# EasyEDA schematic EasyEDA.json
TITLE: Micromouse; REV: 1.0; Date: 2022-02-14; Sheet: 1/1; Drawn By: Adil, Sachin, Rafid; Company: Psycho Rats
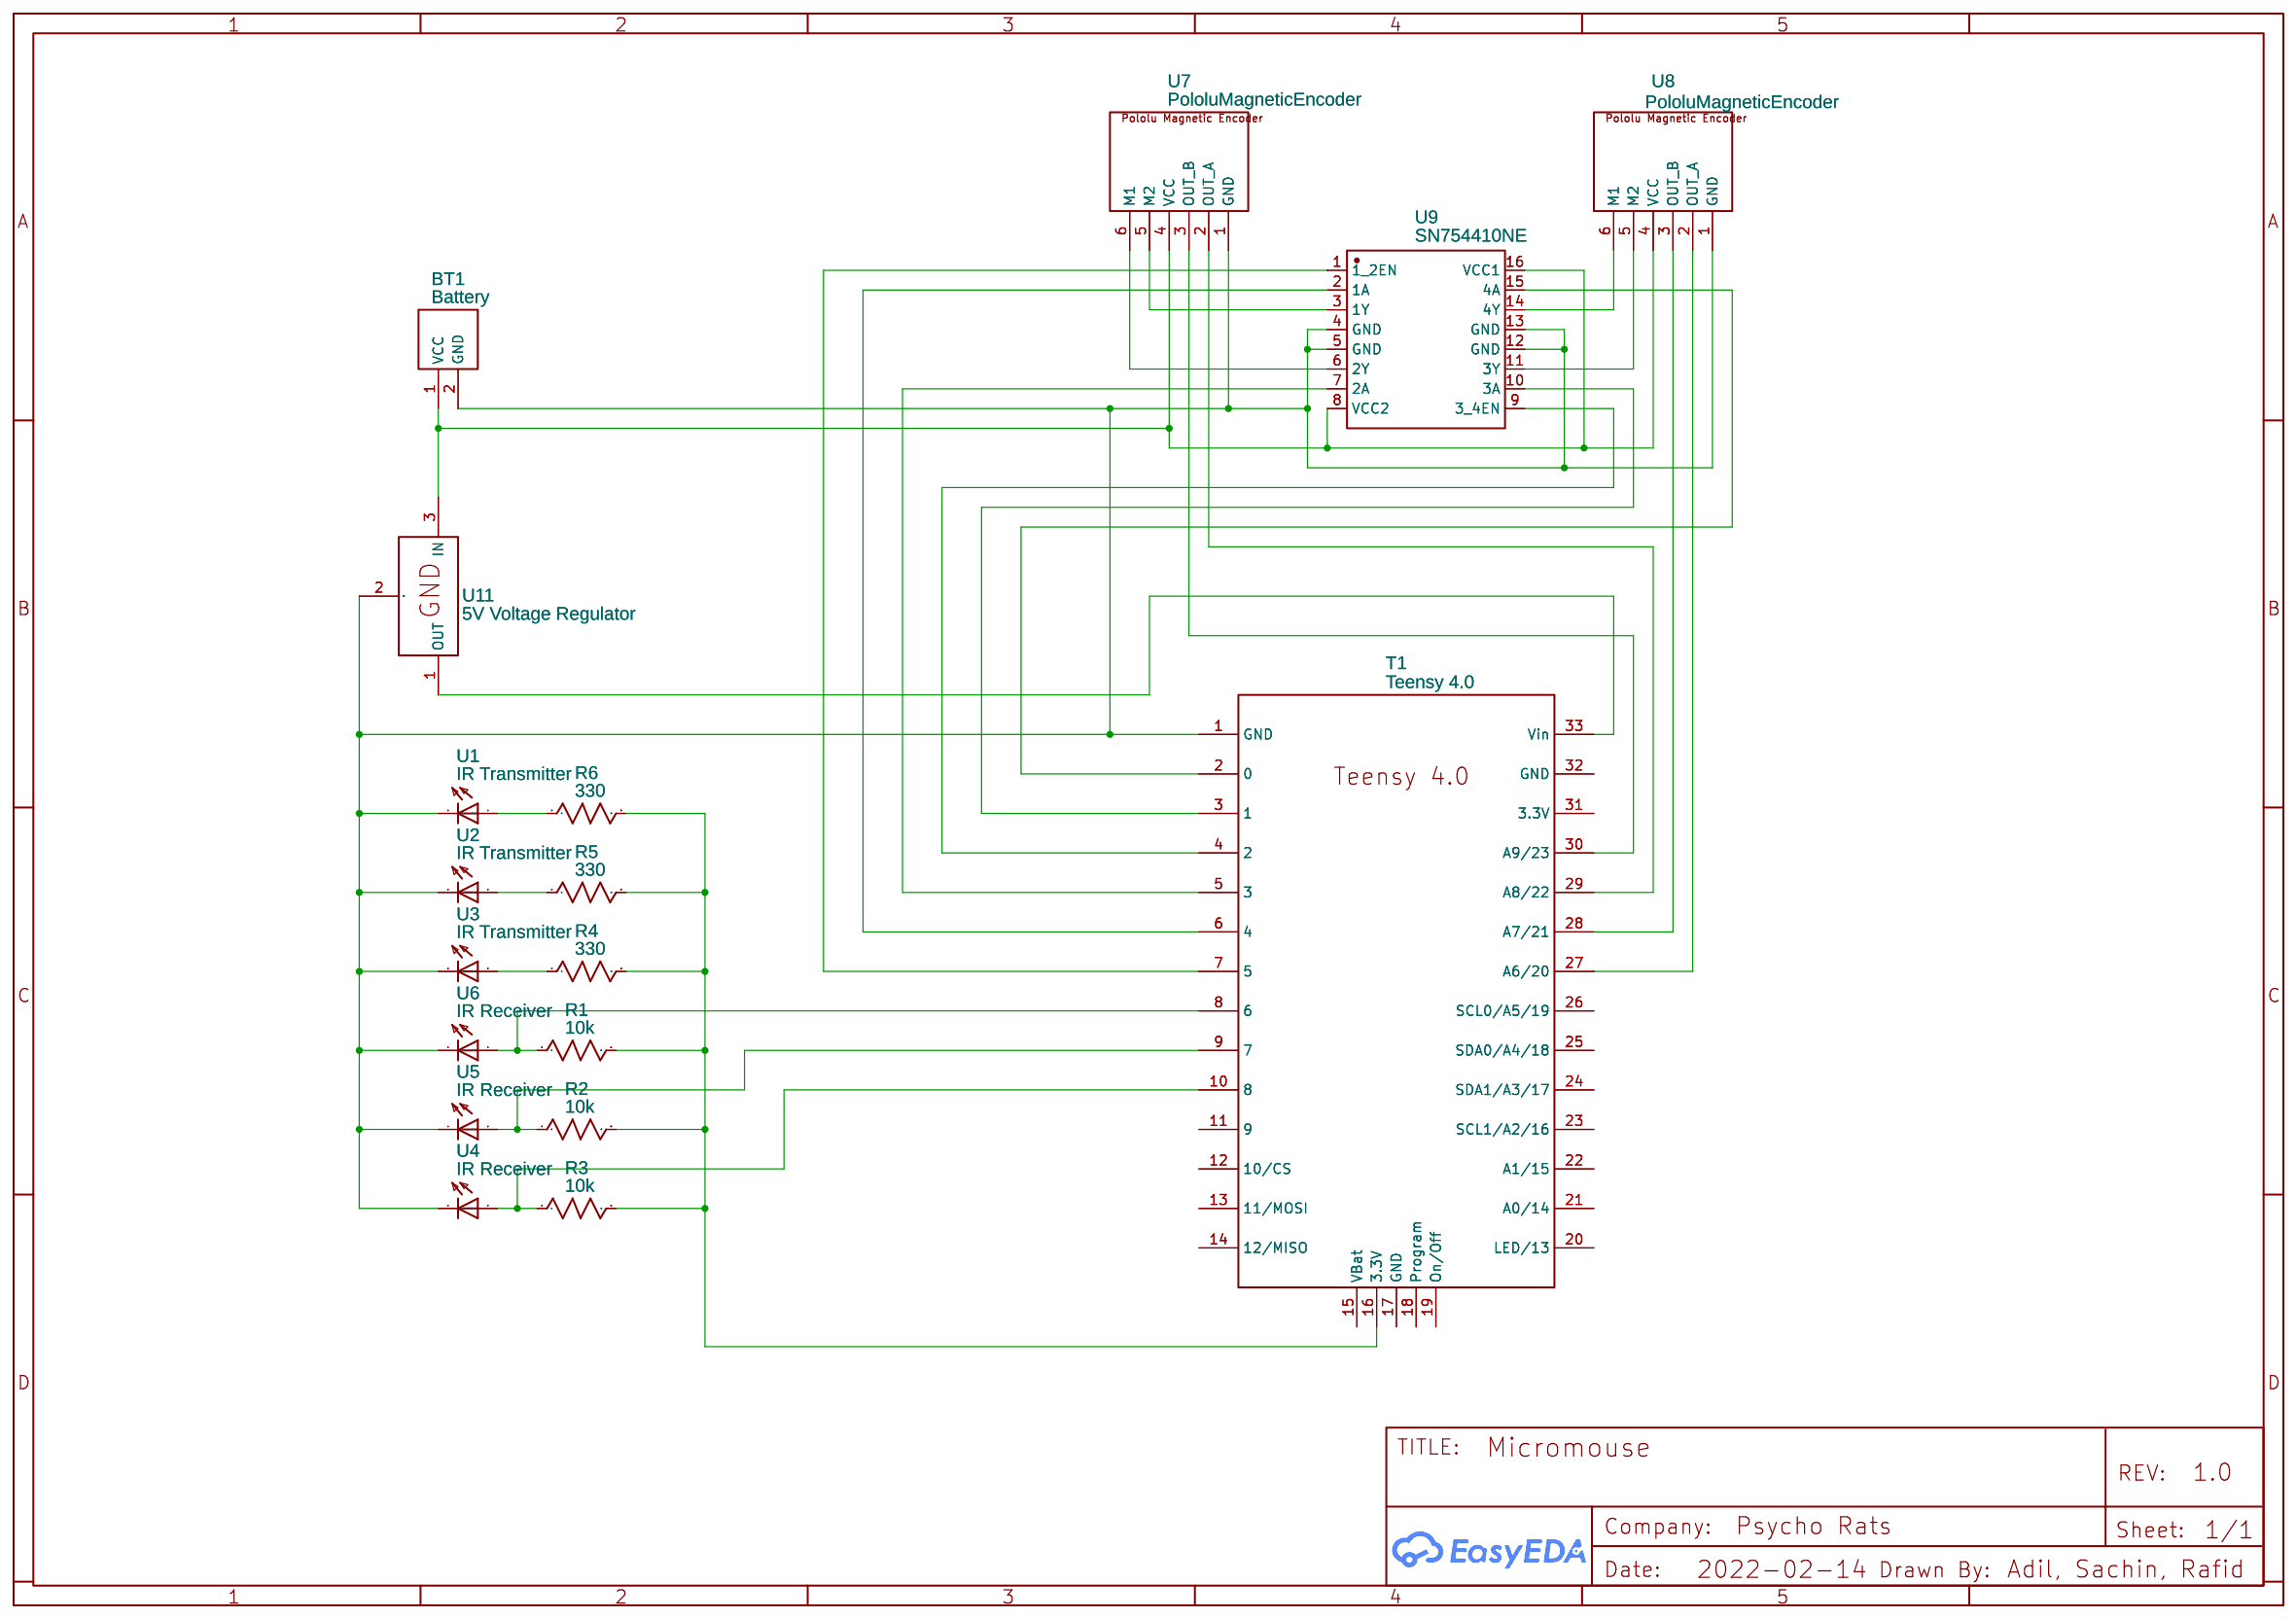
[diagram p0: schematic sheet]

## Parts
BT1  Battery  [59MMX33MM]
R1  10k  [R0603]
R2  10k  [R0603]
R3  10k  [R0603]
R4  330  [R0603]
R5  330  [R0603]
R6  330  [R0603]
T1  Teensy 4.0  [TEENSY4.0]
U1  IR Transmitter  [LED_LED5MM]
U2  IR Transmitter  [LED_LED5MM]
U3  IR Transmitter  [LED_LED5MM]
U4  IR Receiver  [LED_LED5MM]
U5  IR Receiver  [LED_LED5MM]
U6  IR Receiver  [LED_LED5MM]
U7  PololuMagneticEncoder
U8  PololuMagneticEncoder
U9  SN754410NE  [DIP-16_L19.8-W6.5-P2.54-LS7.6-BL]
U11  5V Voltage Regulator  [SOT-89-3_L4.5-W2.5-P1.50-LS4.2-BR]

## Library data of the parts
BT1 = No.52Section side by side battery box: Supplier: LCSC; Manufacturer: ReliaPro; Supplier Part: C5404; JLCPCB Part Class: Extended Part
R1-R6 = R_0603_US: Contributor: LCEDA_Lib
T1 = teensy4.0: Manufacturer: PJRC; Supplier: PJRC; link: https://www.pjrc.com/store/teensy40.html; Contributor: YeonghunKim
U1-U6 = LED_LED5MM: Contributor: Shrutikadere
U7 U8 = PololuMagneticEncoder: Contributor: Luís Gabriel
U9 = SN754410NE: Supplier: LCSC; Supplier Part: C701147; Manufacturer: TI(德州仪器); Contributor: LCSC
U11 = 7805(SOT-89): Supplier: LCSC; Manufacturer: CJ; Manufacturer Part: CJ78L05; image: //image.lceda.cn/szlcsc/C2079.jpg; Supplier Part: C2079; Paste Type: expand; Contributor: LCEDA_Lib

## Nets
Net-(BT1-1): BT1.1(VCC) U7.4(VCC) U8.4(VCC) U9.8(VCC2) U9.16(VCC1) U11.3(IN)
Net-(BT1-2): BT1.2(GND) T1.1(GND) U1.K(C) U2.K(C) U3.K(C) U4.K(C) U5.K(C) U6.K(C) U7.1(GND) U8.1(GND) U9.4(GND) U9.5(GND) U9.12(GND) U9.13(GND) U11.2(GND)
Net-(R1-1): R1.1 T1.8(6) U6.A
Net-(R1-2): R1.2 R2.2 R3.2 R4.2 R5.2 R6.2 T1.16(3.3V)
Net-(R2-1): R2.1 T1.9(7) U5.A
Net-(R3-1): R3.1 T1.10(8) U4.A
Net-(R4-1): R4.1 U3.A
Net-(R5-1): R5.1 U2.A
Net-(R6-1): R6.1 U1.A
Net-(T1-2): T1.2(0) U9.15(4A)
Net-(T1-3): T1.3(1) U9.10(3A)
Net-(T1-4): T1.4(2) U9.9(3_4EN)
Net-(T1-5): T1.5(3) U9.7(2A)
Net-(T1-6): T1.6(4) U9.2(1A)
Net-(T1-7): T1.7(5) U9.1(1_2EN)
Net-(T1-27): T1.27(A6/20) U8.2(OUT A)
Net-(T1-28): T1.28(A7/21) U8.3(OUT B)
Net-(T1-29): T1.29(A8/22) U7.2(OUT A)
Net-(T1-30): T1.30(A9/23) U7.3(OUT B)
Net-(T1-33): T1.33(Vin) U11.1(OUT)
Net-(U7-5): U7.5(M2) U9.3(1Y)
Net-(U7-6): U7.6(M1) U9.6(2Y)
Net-(U8-5): U8.5(M2) U9.11(3Y)
Net-(U8-6): U8.6(M1) U9.14(4Y)

Not connected (* = marked no-connect by the designer): T1 11(9) 12(10/CS) 13(11/MOSI) 14(12/MISO) 15(VBat) 17(GND) 18(Program) 19(On/Off) 20(LED/13) 21(A0/14) 22(A1/15) 23(SCL1/A2/16) 24(SDA1/A3/17) 25(SDA0/A4/18) 26(SCL0/A5/19) 31(3.3V) 32(GND)
